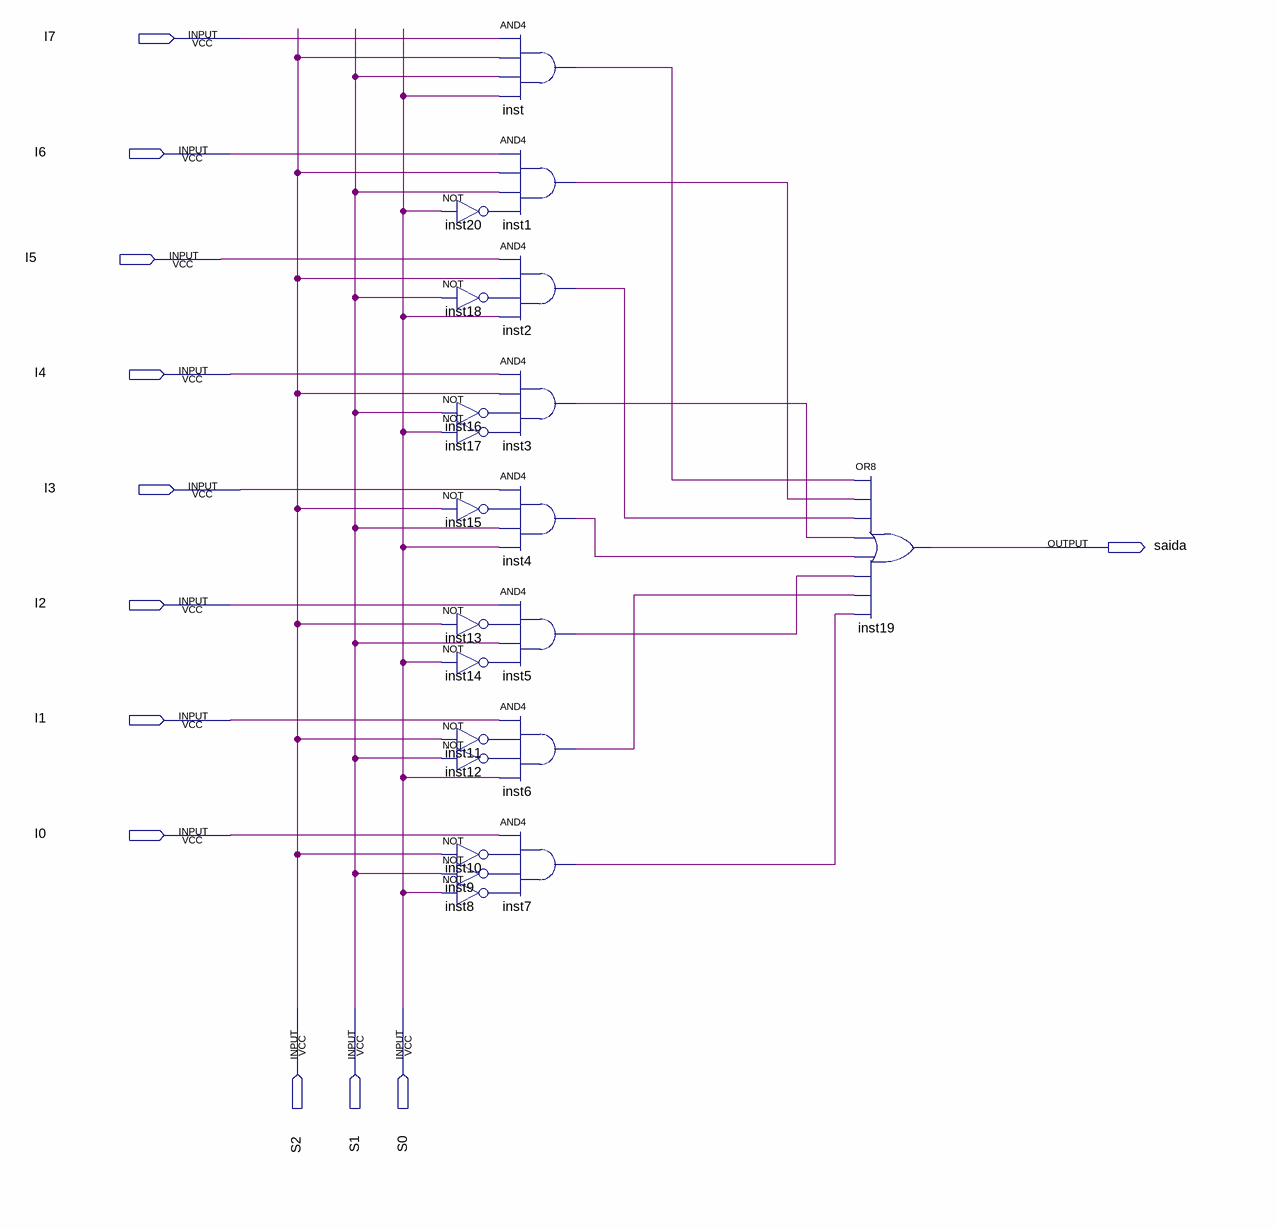
[diagram p0: schematic sheet]
// Quartus schematic Mux8.bdf as structural Verilog: 21 symbols, 12 pins
module Mux8 (
  input  I7,
  input  I6,
  input  I5,
  input  I4,
  input  I3,
  input  I2,
  input  I1,
  input  I0,
  input  S2,
  input  S1,
  input  S0,
  output saida
);

  wire inst1_out, inst2_out, inst3_out, inst4_out, inst5_out, inst6_out, inst7_out, inst8_out, inst9_out,
       inst10_out, inst11_out, inst12_out, inst13_out, inst14_out, inst15_out, inst16_out, inst17_out,
       inst18_out, inst20_out, inst_out;

  and inst (inst_out, I7, S2, S1, S0);
  and inst1 (inst1_out, I6, S2, S1, inst20_out);
  not inst20 (inst20_out, S0);
  and inst2 (inst2_out, I5, S2, inst18_out, S0);
  not inst18 (inst18_out, S1);
  and inst3 (inst3_out, I4, S2, inst16_out, inst17_out);
  not inst16 (inst16_out, S1);
  not inst17 (inst17_out, S0);
  and inst4 (inst4_out, I3, inst15_out, S1, S0);
  not inst15 (inst15_out, S2);
  and inst5 (inst5_out, I2, inst13_out, S1, inst14_out);
  not inst13 (inst13_out, S2);
  not inst14 (inst14_out, S0);
  and inst6 (inst6_out, I1, inst11_out, inst12_out, S0);
  not inst11 (inst11_out, S2);
  not inst12 (inst12_out, S1);
  and inst7 (inst7_out, I0, inst10_out, inst9_out, inst8_out);
  not inst10 (inst10_out, S2);
  not inst9 (inst9_out, S1);
  not inst8 (inst8_out, S0);
  or inst19 (saida, inst_out, inst1_out, inst2_out, inst3_out, inst4_out, inst5_out, inst6_out, inst7_out);
endmodule
